# Altium schematic sheet Ethernet.SchDoc
size A2
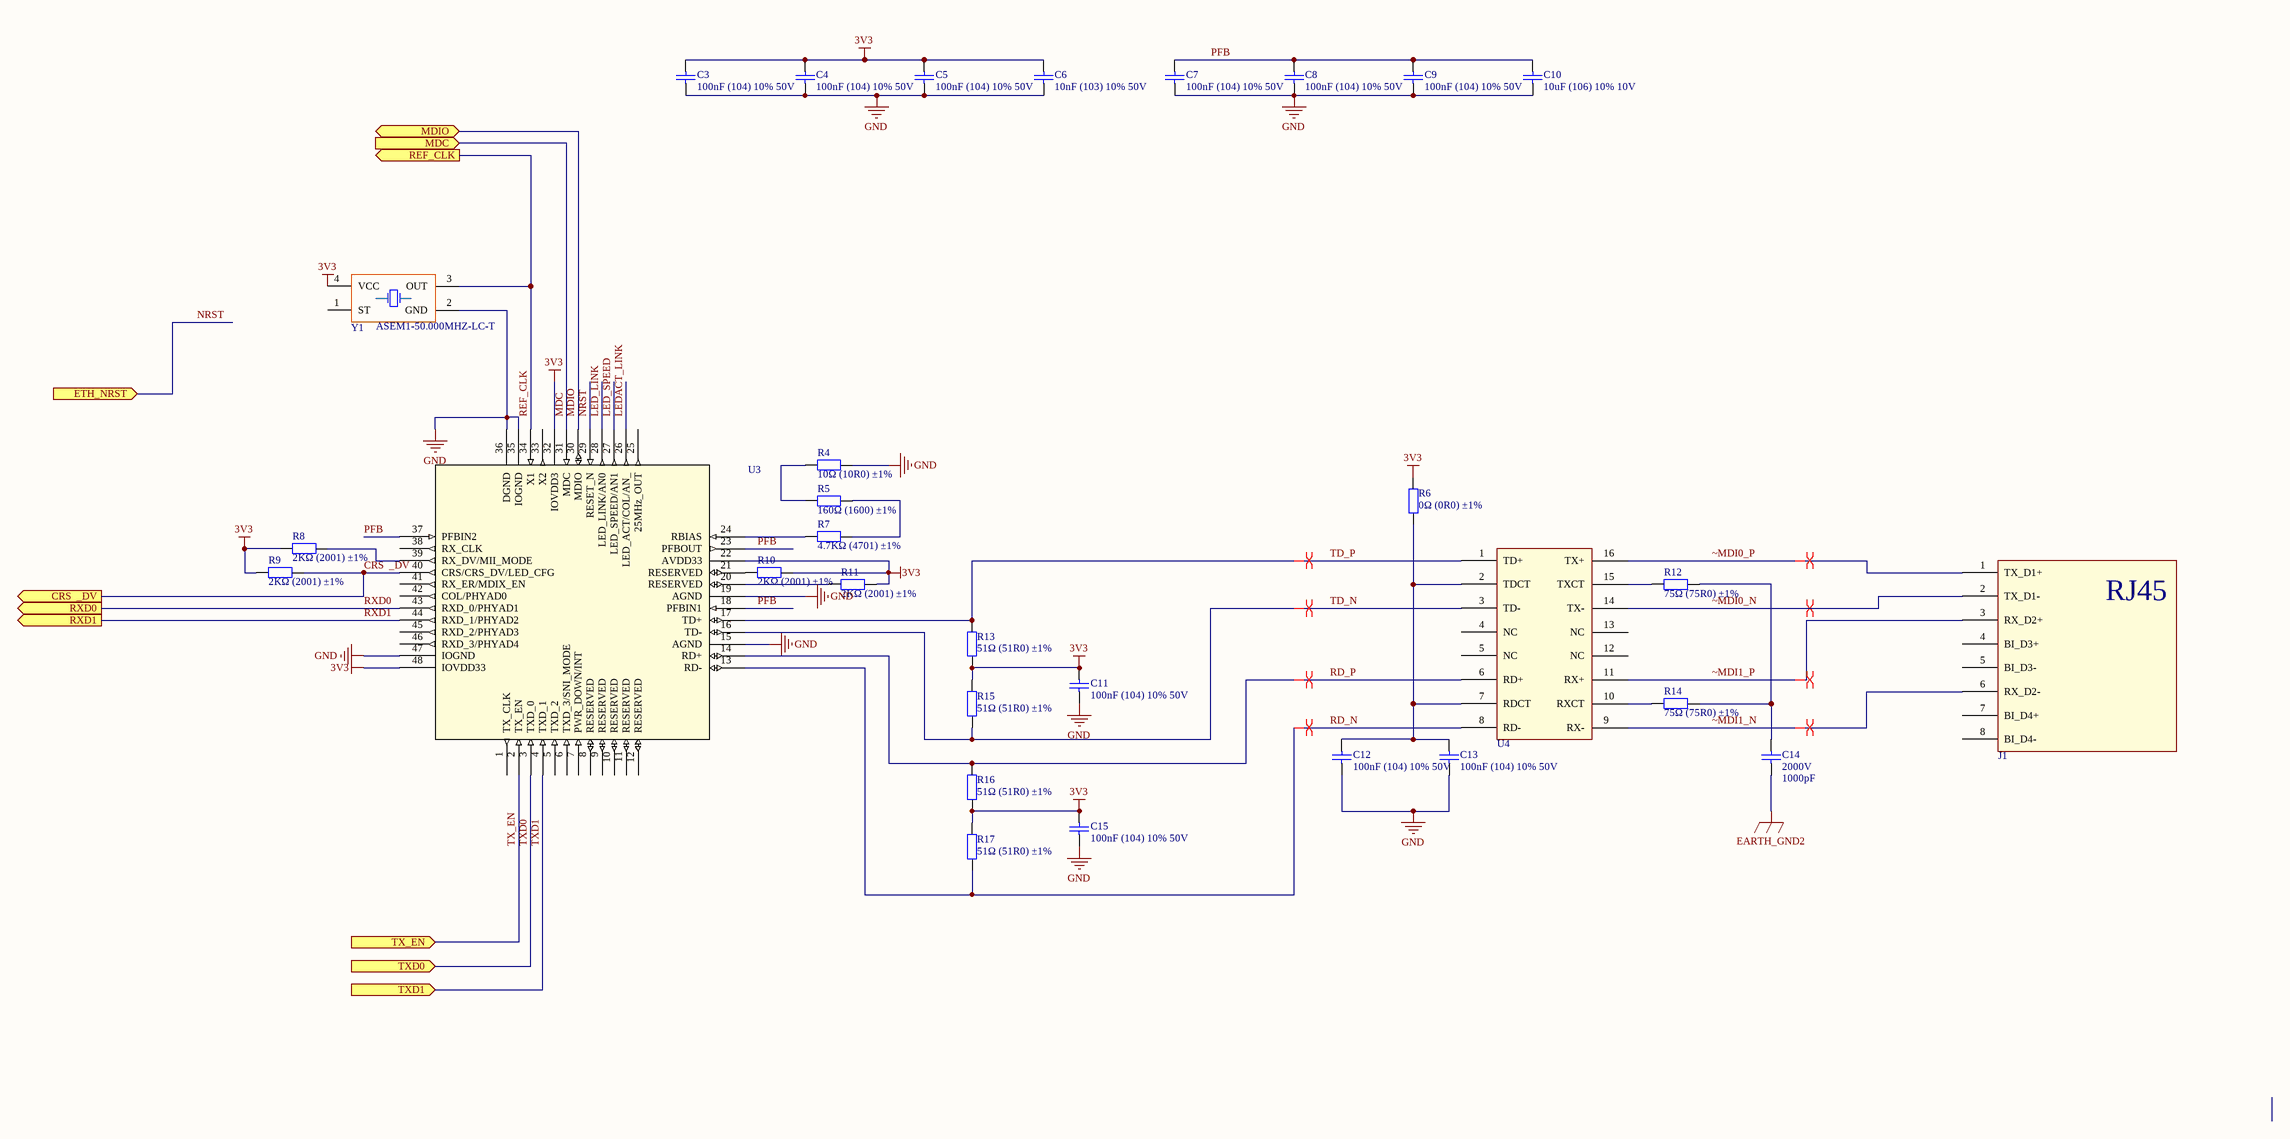
[diagram p0: Ethernet.SchDoc]

## Parts
C3  100nF (104) 10% 50V  [0603_C]
C4  100nF (104) 10% 50V  [0603_C]
C5  100nF (104) 10% 50V  [0603_C]
C6  10nF (103) 10% 50V  [0603_C]
C7  100nF (104) 10% 50V  [0603_C]
C8  100nF (104) 10% 50V  [0603_C]
C9  100nF (104) 10% 50V  [0603_C]
C10  10uF (106) 10% 10V  [0603_C]
C11  100nF (104) 10% 50V  [0603_C]
C12  100nF (104) 10% 50V  [0603_C]
C13  100nF (104) 10% 50V  [0603_C]
C14  2000V  value 1000pF  [CAP1210N]
C15  100nF (104) 10% 50V  [0603_C]
J1  Jack Modular Connector 8p8c (RJ45, Ethernet) Vertical Unshielded Cat3  [RJ45-5556416-1]  (value not drawn)
R4  10Ω (10R0) ±1%  [0603_R]
R5  160Ω (1600) ±1%  [0603_R]
R6  0Ω (0R0) ±1%  [0603_R]
R7  4.7KΩ (4701) ±1%  [0603_R]
R8  2KΩ (2001) ±1%  [0603_R]
R9  2KΩ (2001) ±1%  [0603_R]
R10  2KΩ (2001) ±1%  [0603_R]
R11  2KΩ (2001) ±1%  [0603_R]
R12  75Ω (75R0) ±1%  [0603_R]
R13  51Ω (51R0) ±1%  [0603_R]
R14  75Ω (75R0) ±1%  [0603_R]
R15  51Ω (51R0) ±1%  [0603_R]
R16  51Ω (51R0) ±1%  [0603_R]
R17  51Ω (51R0) ±1%  [0603_R]
U3  IC TXRX ETHERNET 48LQFP  [48-LQFP]  (value not drawn)
U4  TRANSFORMER  [Bel_transformer]  (value not drawn)
Y1  Part Number: ASEM1-50.000MHZ-LC-T  [SMD-3225]  (hidden comment: Oscillator)

## Ports
CRS  _DV (out), ETH_NRST (in), MDC (in), MDIO (bidir), REF_CLK (out), RXD0 (out), RXD1 (out), TX_EN (in), TXD0 (in), TXD1 (in)

## Nets
3V3: C3.2 C4.2 C5.2 C6.2 C11.2 C15.2 R6.2 R8.2 R9.2 R10.1 R11.1 R13.1 R15.2 R16.1 R17.2 U3.22(AVDD33) U3.32(IOVDD3) U3.48(IOVDD33) Y1.4(VCC)
EARTH_GND2: C14.1
GND: C3.1 C4.1 C5.1 C6.1 C7.1 C8.1 C9.1 C10.1 C11.1 C12.2 C13.1 C15.1 R4.2 U3.15(AGND) U3.19(AGND) U3.35(IOGND) U3.36(DGND) U3.47(IOGND) Y1.2(GND)
CRS  _DV: R9.1 U3.40(CRS/CRS_DV/LED_CFG) ; port CRS  _DV
LED_LINK: U3.28(LED_LINK/AN0)
LED_SPEED: U3.27(LED_SPEED/AN1)
LEDACT_LINK: U3.26(LED_ACT/COL/AN_)
MDC: U3.31(MDC) ; port MDC
MDIO: U3.30(MDIO) ; port MDIO
NRST: U3.29(RESET_N) ; port ETH_NRST
PFB: C7.2 C8.2 C9.2 C10.2 U3.18(PFBIN1) U3.23(PFBOUT) U3.37(PFBIN2)
RD_N: R17.1 U3.13(RD-) U4.8(RD-)
RD_P: R16.2 U3.14(RD+) U4.6(RD+)
REF_CLK: U3.34(X1) Y1.3(OUT) ; port REF_CLK
RXD0: U3.43(RXD_0/PHYAD1) ; port RXD0
RXD1: U3.44(RXD_1/PHYAD2) ; port RXD1
TD_N: R15.1 U3.16(TD-) U4.3(TD-)
TD_P: R13.2 U3.17(TD+) U4.1(TD+)
TX_EN: U3.2(TX_EN) ; port TX_EN
TXD0: U3.3(TXD_0) ; port TXD0
TXD1: U3.4(TXD_1) ; port TXD1
~MDI0_N: J1.2(TX_D1-) U4.14(TX-)
~MDI0_P: J1.1(TX_D1+) U4.16(TX+)
~MDI1_N: J1.6(RX_D2-) U4.9(RX-)
~MDI1_P: J1.3(RX_D2+) U4.11(RX+)
NetC12_1: C12.1 C13.2 R6.1 U4.2(TDCT) U4.7(RDCT)
NetC14_2: C14.2 R12.2 R14.2
NetR4_1: R4.1 R5.1
NetR5_2: R5.2 R7.2
NetR7_1: R7.1 U3.24(RBIAS)
NetR8_1: R8.1 U3.39(RX_DV/MII_MODE)
NetR10_2: R10.2 U3.21(RESERVED)
NetR11_2: R11.2 U3.20(RESERVED)
NetR12_1: R12.1 U4.15(TXCT)
NetR14_1: R14.1 U4.10(RXCT)

Not connected (* = marked no-connect by the designer): J1 4(BI_D3+) 5(BI_D3-) 7(BI_D4+) 8(BI_D4-); U3 1(TX_CLK) 5(TXD_2) 6(TXD_3/SNI_MODE) 7(PWR_DOWN/INT) 8(RESERVED) 9(RESERVED) 10(RESERVED) 11(RESERVED) 12(RESERVED) 25(25MHz_OUT) 33(X2) 38(RX_CLK) 41(RX_ER/MDIX_EN) 42(COL/PHYAD0) 45(RXD_2/PHYAD3) 46(RXD_3/PHYAD4); U4 4(NC) 5(NC) 12(NC) 13(NC); Y1 1(ST)

## Layout directives
differential pair: RD_N, RD_P, TD_N, TD_P, ~MDI0_N, ~MDI0_P, ~MDI1_N, ~MDI1_P

## Notes on the sheet
- (in symbol 5556416-1) RJ45

## Library data of the parts
C3-C5 C7-C9 C11-C13 C15 = 0603 100nF (104) 10% 50V: 贴片电容; ComponentLink1Description: 供应商链接; ComponentLink1URL: http://www.szlcsc.com/product/details_15331.html; Package: 0603; Supplier: LC; SuppliersPartNumber: C14663
C6 = 0603 10nF (103) 10% 50V: 贴片电容; ComponentLink1Description: 供应商链接; ComponentLink1URL: http://www.szlcsc.com/product/details_58143.html; Package: 0603; Supplier: LC; SuppliersPartNumber: C57112
C10 = 0603 10uF (106) 10% 10V: 贴片电容; ComponentLink1Description: 供应商链接; ComponentLink1URL: http://www.szlcsc.com/product/details_20411.html; Package: 0603; Supplier: LC; SuppliersPartNumber: C19702
C14 = CAP 1000pF ±10% 2000V (2kV) Ceramic Capacitor X7R 1210 (3225 Metric): Manufacturer: Samsung Electro-Mechanics; Manufacturer Part Number: CL32B102KJFNNNE; Unit Price in Quantity: 0.0884; Part Number: CAP 1000pF ±10% 2000V (2kV) Ceramic Capacitor X7R 1210 (3225 Metric); Component Type: Standard; Mounting Type: smt; Supplier 1: Digikey; Supplier 1 Part Number: 1276-3316-6-ND; Part URL-Supplier 1: https://www.digikey.com/product-detail/en/samsung-electro-mechanics/CL32B102KJFNNNE/1276-3316-6-ND/3893831; Unit Price-Supplier 1: 0.34; Price Break: 1000; Vendor/Distributor: Digikey; Package: 1210
J1 = 5556416-1: RJ45 connector 180 degrees; Manufacturer: TE; Unit Price in Quantity: .5722; Part Number: 5556416-1; Mounting Type: thru-hole; Package: Header; Component Type: Standard; Pin Count: 8; Manufacturer Part Number: 5556416-1; Supplier 1: Digikey; Supplier 1 Part Number: A31428-ND; Unit Price-Supplier 1: 1.04; Price Break: 1000; Vendor/Distributor: Digikey
R4 = 0603 10Ω (10R0) 1%: 贴片电阻; ComponentLink1Description: 供应商链接; ComponentLink1URL: http://www.szlcsc.com/product/details_23586.html; Package: 0603; Supplier: LC; SuppliersPartNumber: C22859
R5 = 0603 160Ω (1600) 1%: 贴片电阻; ComponentLink1Description: 供应商链接; ComponentLink1URL: http://www.szlcsc.com/product/details_23541.html; Package: 0603; Supplier: LC; SuppliersPartNumber: C22814
R6 = 0603 0Ω (0R0) 1%: 贴片电阻; ComponentLink1Description: 供应商链接; ComponentLink1URL: http://www.szlcsc.com/product/details_21903.html; Package: 0603; Supplier: LC; SuppliersPartNumber: C21189
R7 = 0603 4.7KΩ (4701) 1%: 贴片电阻; ComponentLink1Description: 供应商链接; ComponentLink1URL: http://www.szlcsc.com/product/details_23889.html; Package: 0603; Supplier: LC; SuppliersPartNumber: C23162
R8-R11 = 0603 2KΩ (2001) 1%: 贴片电阻; ComponentLink1Description: 供应商链接; ComponentLink1URL: http://www.szlcsc.com/product/details_23702.html; Package: 0603; Supplier: LC; SuppliersPartNumber: C22975
R12 R14 = 0603 75Ω (75R0) 1%: 贴片电阻; ComponentLink1Description: 供应商链接; ComponentLink1URL: http://www.szlcsc.com/product/details_4682.html; Package: 0603; Supplier: LC; SuppliersPartNumber: C4275
R13 R15-R17 = 0603 51Ω (51R0) 1%: 贴片电阻; ComponentLink1Description: 供应商链接; ComponentLink1URL: http://www.szlcsc.com/product/details_23924.html; Package: 0603; Supplier: LC; SuppliersPartNumber: C23197
U3 = DP83848CVVX/NOPB: Manufacturer: Texas Instruments; Unit Price in Quantity: 3.2349; Part Number: DP83848CVVX/NOPB; Component Type: Standard; Pin Count: 48; Manufacturer Part Number: DP83848CVVX/NOPB; Mounting Type: fine pitch; Package: 48-LQFP; Supplier 1: Digikey; Supplier 1 Part Number: DP83848CVVX/NOPBCT-ND; Unit Price-Supplier 1: 5.16; Price Break: 500
U4 = MODULE XFRMR LAN 10/100B-TX SMD: Manufacturer: Bel Fuse Inc.; Manufacturer Part Number: S558-5999-U7-F; Unit Price in Quantity: 1.9439; Part Number: MODULE XFRMR LAN 10/100B-TX SMD; Mounting Type: smt; Package: Non-standard; Component Type: Standard; DatasheetDocument: https://www.belfuse.com/resources/ICMs/lan-/S558-5999-U7-F.pdf; Supplier 1: Digikey; Supplier 1 Part Number: 507-1463-1-ND; Part URL-Supplier 1: https://www.digikey.sg/product-detail/zh/bel-fuse-inc/S558-5999-U7-F/507-1463-1-ND/2108047; Unit Price-Supplier 1: 3.6; Price Break: 900; Vendor/Distributor: Digikey
Y1 = ASEM1-50.000MHZ-LC-T: OSC MEMS 50.000MHZ CMOS SMD; Manufacturer: Abracon LLC; Unit Price in Quantity: .8712; Mounting Type: smt; Package: SMD3225; Component Type: Standard; Manufacturer Part Number: ASEM1-50.000MHZ-LC-T; Supplier 1: Digikey; Supplier 1 Part Number: 535-9774-1-ND; Unit Price-Supplier 1: 1.26; Price Break: 500; Vendor/Distributor: Digikey